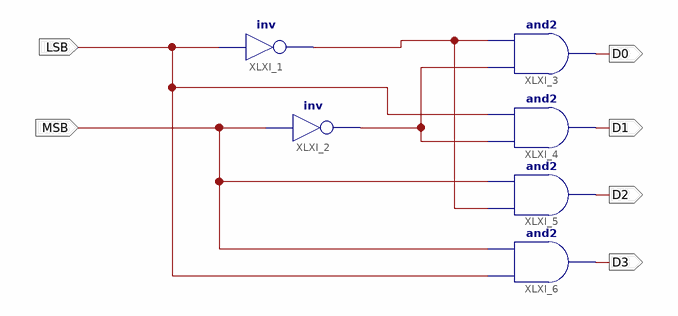
[diagram p0: schematic sheet 1]
// Xilinx ISE schematic decode2to4.sch (spartan6) as structural Verilog: 6 symbols, 6 ports
module decode2to4 (
  input  LSB,
  input  MSB,
  output D0,
  output D1,
  output D2,
  output D3
);

  wire XLXN_4, XLXN_9;

  not XLXI_1 (XLXN_9, LSB);
  not XLXI_2 (XLXN_4, MSB);
  and XLXI_3 (D0, XLXN_4, XLXN_9);
  and XLXI_4 (D1, XLXN_4, LSB);
  and XLXI_5 (D2, XLXN_9, MSB);
  and XLXI_6 (D3, LSB, MSB);
endmodule
